# EAGLE design SurfaceEEG_Hub_V1.0 (EAGLE 7.6.0)
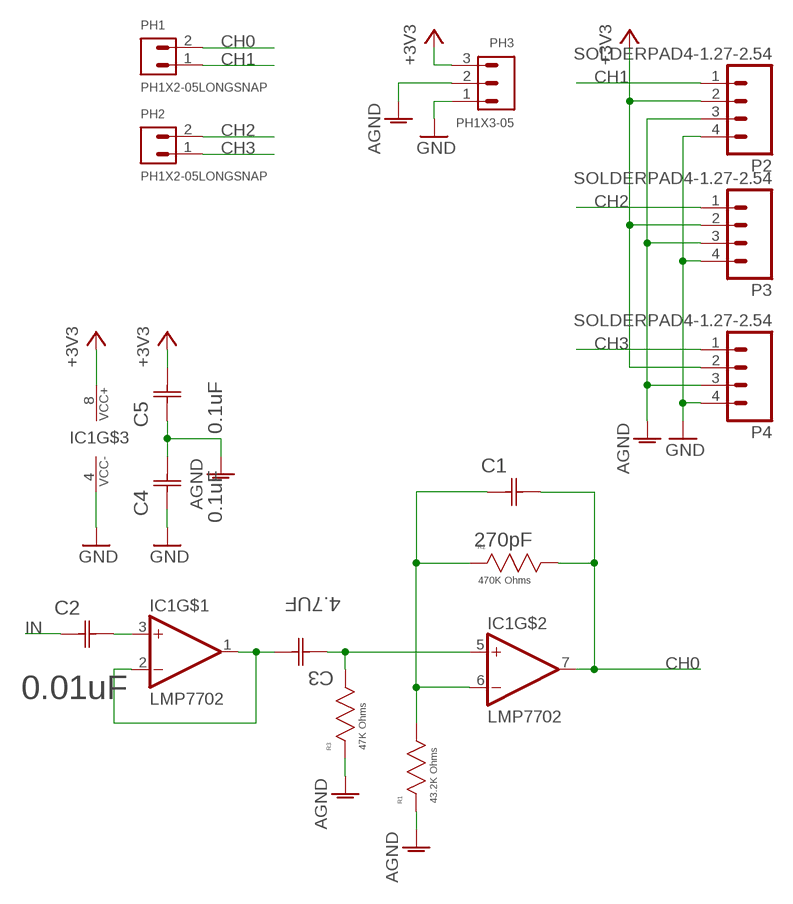
[diagram p0: schematic, sheet 1]

## Parts
C1  270pF  06035A271JAT2A  [CAPC1608X90N]
C2  0.01uF  C0402C103J3RACTU  [CAPC1005X60N]
C3  4.7UF  06036D475MAT2A  [CAPC1608X90N]
C4  0.1uF  04023C104KAT2A  [CAPC1005X60N]
C5  0.1uF  04023C104KAT2A  [CAPC1005X60N]
IC1  LMP7702  [VSSOP8]
P2  SOLDERPAD4-1.27-2.54  [SMD1,27-2,54]
P3  SOLDERPAD4-1.27-2.54  [SMD1,27-2,54]
P4  SOLDERPAD4-1.27-2.54  [SMD1,27-2,54]
PH1  PH1X2-05LONGSNAP  [PHLS005-1-2]
PH2  PH1X2-05LONGSNAP  [PHLS005-1-2]
PH3  PH1X3-05  [PH005-1-3]
R1  43.2K Ohms  RC0603FR-0743K2L  [RESC1608X60N]
R2  470K Ohms  RC0603FR-07470KL  [RESC1608X60N]
R3  47K Ohms  RC0603FR-0747KL  [RESC1608X60N]

## Nets
+3V3: C5.1(C2) IC1.8(VCC+) P2.2 P3.2 P4.2 PH3.3
AGND: C4.1(C2) C5.2(C1) P2.3 P3.3 P4.3 PH3.2 R1.2(R2) R3.2(R2)
CH0: C1.2(C2) IC1.7(OUT) PH1.2 R2.1(R1)
CH1: P2.1 PH1.1
CH2: P3.1 PH2.2
CH3: P4.1 PH2.1
GND: C4.2(C1) IC1.4(VCC-) P2.4 P3.4 P4.4 PH3.1
IN: C2.1(C1)
N$1: C2.2(C2) IC1.3(IN+)
N$2: C1.1(C1) IC1.6(IN-) R1.1(R1) R2.2(R2)
N$3: C3.1(C1) IC1.5(IN+) R3.1(R1)
SHIELD: C3.2(C2) IC1.1(OUT) IC1.2(IN-)

## Library data of the parts
C1 = (manufact)-capacitors-AVX-element14:06035A271JAT2A: CAPACITOR , 0603; MPN: 06035A271JAT2A; OC_FARNELL: 1734627; OC_NEWARK: 96M1275; SUPPLIER: AVX; TOLERANCE: ± 5%; VOLTAGERATING: 50V
C2 = (manufact)-Kemet-element14:C0402C103J3RACTU: CAPACITOR, 0402; MPN: C0402C103J3RACTU; OC_FARNELL: 1692285; OC_NEWARK: 78H4779; SUPPLIER: Kemet; TOLERANCE: ±5%; VOLTAGERATING: 25V
C3 = (manufact)-capacitors-AVX-element14:06036D475MAT2A: Capacitor, 0603; MPN: 06036D475MAT2A; OC_FARNELL: 1740638; OC_NEWARK: 96M1296; SUPPLIER: AVX; TOLERANCE: ±20%; VOLTAGERATING: 6.3V
C4 C5 = (manufact)-capacitors-AVX-element14:04023C104KAT2A: Capacitor 0402; MPN: 04023C104KAT2A; OC_FARNELL: 1867948; OC_NEWARK: 37T9047; SUPPLIER: AVX; TOLERANCE: ±10%; VOLTAGERATING: 25V
IC1 = (custom)-new-components:LMP7702: The library has been designed by Richard Magdycz <https://www.facebook.com/groups/eaglecadsoftUK>; MPN: LMP7702MM/NOPB
P2-P4 = (custom)-new-components:SOLDERPAD4-1.27-2.54
PH1 PH2 = pel_hdr:PH1X2
PH3 = pel_hdr:PH1X3
R1 = (manufact)-resistors-YAGEO-element14:RC0603FR-0743K2L: RESISTOR, 0603; MPN: RC0603FR-0743K2L; OC_FARNELL: -; OC_NEWARK: 19P7489; SUPPLIER: Yageo; TOLERANCE: ±1%; WATTAGE: 1/10 W
R2 = (manufact)-resistors-YAGEO-element14:RC0603FR-07470KL: RESISTOR, 0603; MPN: RC0603FR-07470KL; OC_FARNELL: 1117267; OC_NEWARK: 68R0098; SUPPLIER: Yageo; TOLERANCE: ±1%; WATTAGE: 1/10 W
R3 = (manufact)-resistors-YAGEO-element14:RC0603FR-0747KL: RESISTOR, 0603; MPN: RC0603FR-0747KL; OC_FARNELL: 1117266; OC_NEWARK: 26M6759; SUPPLIER: Yageo; TOLERANCE: ±1%; WATTAGE: 1/10 W

## Board
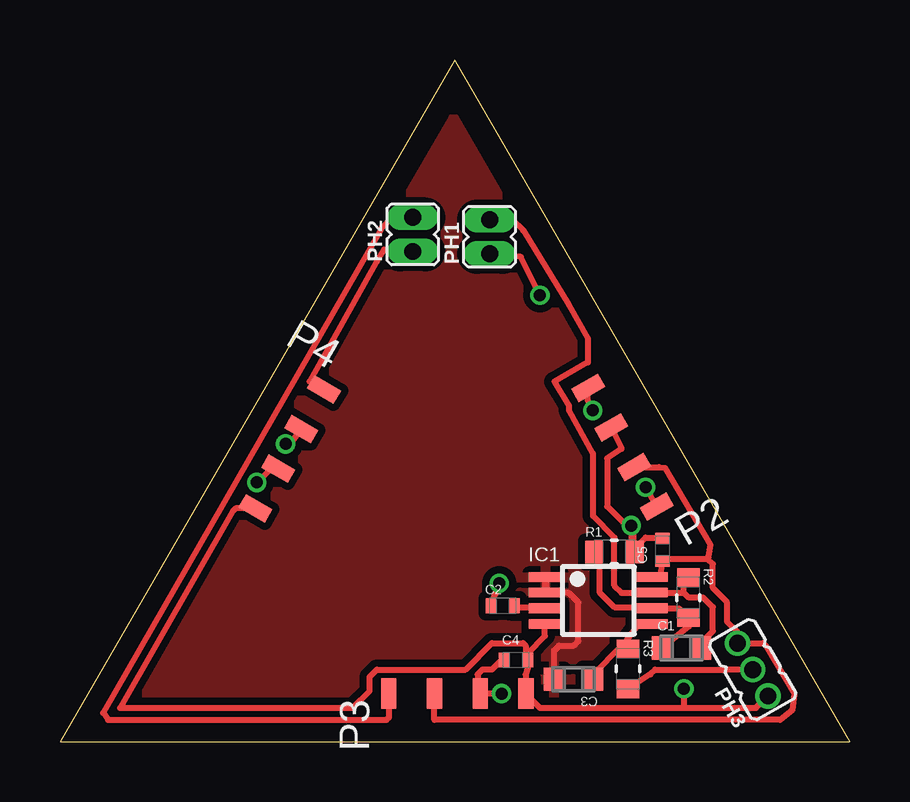
[diagram p1: board, top side]
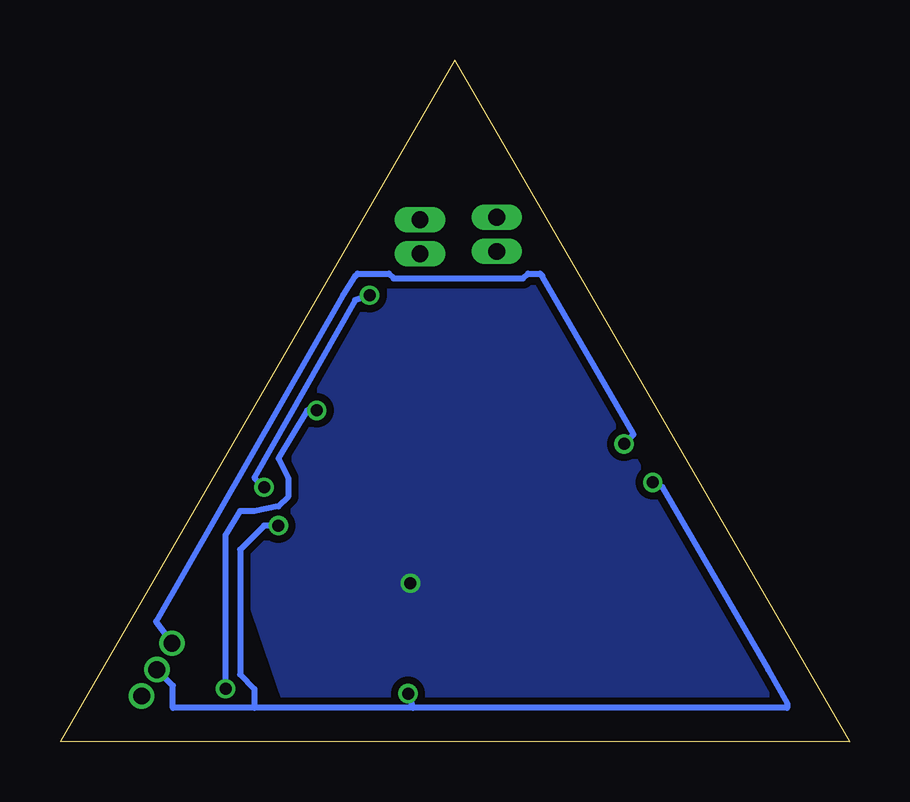
[diagram p2: board, bottom side, seen from below]

Size 32.9 x 28.4 mm. Coordinates in mm from the lower left corner, seen from the top.
Outline: 0,0 32.9,0 16.45,28.4 0,0
Copper layers (1*16): Top 0.035mm / dielectric 1.5mm / Bottom 0.035mm
Design rules "rules_Kharkiv": minimum track width 8mil, minimum drill 15mil, track to track 0.2mm, track to pad 0.2mm, pad to pad 0.2mm, via to via 0.2mm, smd to smd 0.2mm, copper to edge 0.7mm, drill to drill 8mil, minimum pad ring 7mil, minimum via ring 6mil, stop-mask expansion 4mil, vias tented up to drill 0mil, thermal gap 10mil

### Footprints (pad centres in the part's own frame; a part is rotated, then mirrored left to right if it is on the bottom)
CAPC1608X90N = smd 0.864 x 0.965: 1 -0.813,0; 2 0.813,0
CAPC1005X60N = smd 0.457 x 0.61: 1 -0.483,0; 2 0.483,0
VSSOP8 = smd 1.4 x 0.4: 1 -2.2,0.975; 2 -2.2,0.325; 3 -2.2,-0.325; 4 -2.2,-0.975; 5 2.2,-0.975; 6 2.2,-0.325; 7 2.2,0.325; 8 2.2,0.975
SMD1,27-2,54 = smd 0.635 x 1.27: 1 0,0; 2 1.905,0; 3 3.81,0; 4 5.715,0
PHLS005-1-2 = drill 0.7 pad 1.016 long: 1 -0.076,0; 2 1.346,0
PH005-1-3 = drill 0.7 pad 1.016: 1 0,0; 2 1.27,0; 3 2.54,0
RESC1608X60N = smd 0.762 x 0.94: 1 -0.838,0; 2 0.838,0

### Placement (x,y rotation side)
C1  25.9,3.9 0 top
C2  18.45,5.66 0 top
C3  21.4,2.6 180 top
C4  19,3.4 0 top
C5  25.1,8 90 top
IC1  22.43,5.88 0 top
P2  24.87,9.79 120 top
P3  13.7,2 0 top
P4  11,14.67 240 top
PH1  17.9,20.4 90 top
PH2  14.7,20.5 90 top
PH3  29.5,1.9 120 top
R1  23.1,7.9 0 top
R2  26.18,6 270 top
R3  23.67,3.03 270 top

### Tracks (layer width: path | path; a pad name or v marks a point on that pad's centre or on a via)
+3V3  (via drill 0.5 pad 0.25)
  Top 0.254: P4.2 9.6,12.4 v9.4,12.4 | P3.2 15.6,0.9 30,0.9 30.5,1.3 30.6,2 29.4,4 29.3,4.1 PH3.3 28.23,4.57 27.8,5 27.8,5.8 27.2,6.4 27.2,7.4 27,7.6 | IC1.8 25.03,6.85 C5.1 25.38,7.6 27,7.6 | P2.2 24.96,11.44 25.2,11.4 27.1,8.2 27,7.6
  Bottom 0.254: v9.4,12.4 9,12.8 12.8,19.4 12.9,19.5 13.4,19.5 13.6,19.3 19,19.3 19.2,19.5 20.5,19.5 20.6,19.4 21.1,18.6 28.9,5 PH3.3
AGND  (via drill 0.5 pad 0.25)
  Top 0.254: P4.3 8.67,11.47 8.67,11.27 v8.2,10.8 | P2.3 23.4,12.2 22.8,11.8 22.8,9.8 23.8,8.8 23.8,8.04 R1.2 23.9,8.1 | C4.1 18.32,3.32 18,3 17.6,3 17.4,2.8 17.4,2.09 P3.3 v18.4,2 | PH3.2 27.8,3 24.8,3 24.6,2.8 R3.2 | 24.98,8.4 C5.2 25.08,8.5 24.4,8.5 24,8.1 23.9,8.1 | 23.9,8.1 23.9,8.9 v23.8,9
  Bottom 0.254: PH3.2 28.2,2.34 28.2,1.4 24.8,1.4 | 18.2,1.4 2.6,1.4 2.6,1.6 3.4,3 7.8,10.6 v8.2,10.8 | 18.2,1.4 24.8,1.4 | v18.4,2 18.2,1.4 | v23.8,9 24.4,9 25.4,8 25.4,2.8 24.8,2.2 24.8,1.4
CH0
  Top 0.254: C1.2 26.71,4.11 27.2,4.6 27.2,5.6 26.8,6 26.2,6 26,6.2 | 26,6.2 25.6,6.2 IC1.7 23.4,6.2 23.1,6.5 23.1,8.5 22.2,9.4 22.2,12 21.2,13.8 21.2,14 20.6,15 22,15.8 22,16.8 21.2,18.2 19.3,21.3 18.85,21.75 PH1.2 | 26,6.2 26,6.66 R2.1
CH1  (via drill 0.5 pad 0.25)
  Top 0.254: P2.1 v24.4,10.6 | v20,18.6 19.2,20.2 PH1.1
  Bottom 0.254: v24.4,10.6 24.8,11 20.6,18.4 v20,18.6
CH2
  Top 0.254: PH2.2 13.85,21.85 13.4,21.4 1.8,1.2 2,0.9 13.6,0.9 13.7,1 13.7,1.5 13.8,1.5 13.6,1.7 13.6,2 P3.1
CH3
  Top 0.254: P4.1 10.4,15 13.2,20 13.5,20.5 PH2.1
GND  (via drill 0.5 pad 0.25)
  Top 0.254: 26,1.4 20,1.4 19.4,2 P3.4 19.4,2.02 19.4,2.8 19.48,3.08 C4.2 | 26,1.4 29,1.4 PH3.1 | P4.4 7.32,9.72 7.2,9.6 2.5,1.4 12.2,1.4 12.9,2.1 12.9,2.7 13.2,3 16.9,3 18,4.1 19.3,4.1 19.4,4 19.4,3.68 C4.2 | v26,2.2 26,1.4 | v22.2,13.8 22,14.2 P2.4 | C4.2 19.48,3.68 20.2,4.4 20.2,4.88 IC1.4
  Bottom 0.254: v22.2,13.8 22.6,13.8 23.8,11.8 23.4,11 23.4,10.2 23.8,9.8 24.8,9.6 25.4,9.6 26,8.6 v26,2.2
IN  (via drill 0.5 pad 0.3)
  Top 0.254: C2.1 v18.3,6.6
  pour Bottom (isolate 0.305): 16.4,24.7 3.3,1.8 23.5,1.7 26,9
N$1
  Top 0.254: C2.2 18.86,5.46 19,5.6 20.18,5.6 IC1.3
N$2
  Top 0.254: 25.2,3.6 C1.1 25.2,4 26.2,4.8 26.2,5.14 R2.2 25.79,5.55 IC1.6 24.58,5.6 23.1,5.6 22.5,6.2 22.5,7.84 R1.1
N$3
  Top 0.254: IC1.5 24.11,4.91 23.6,4.2 23.6,3.74 R3.1 23.6,3.8 23.2,3.8 22.4,3 C3.1
SHIELD
  Top 0.254: C3.2 20.59,3.79 20.8,4 21.4,4 21.6,4.2 21.6,5.8 21.2,6.2 20.04,6.2 IC1.2
  Top 0.305: IC1.1 IC1.2
  pour Top (isolate 0.305): 16.4,26 1.9,1.1 30.8,1.1